# EasyEDA Pro project 轮腿PCB.eprj, schematic Schematic3

## Sheets
1 P1: Board Name: 无刷驱动; Create Date: 2026-03-15
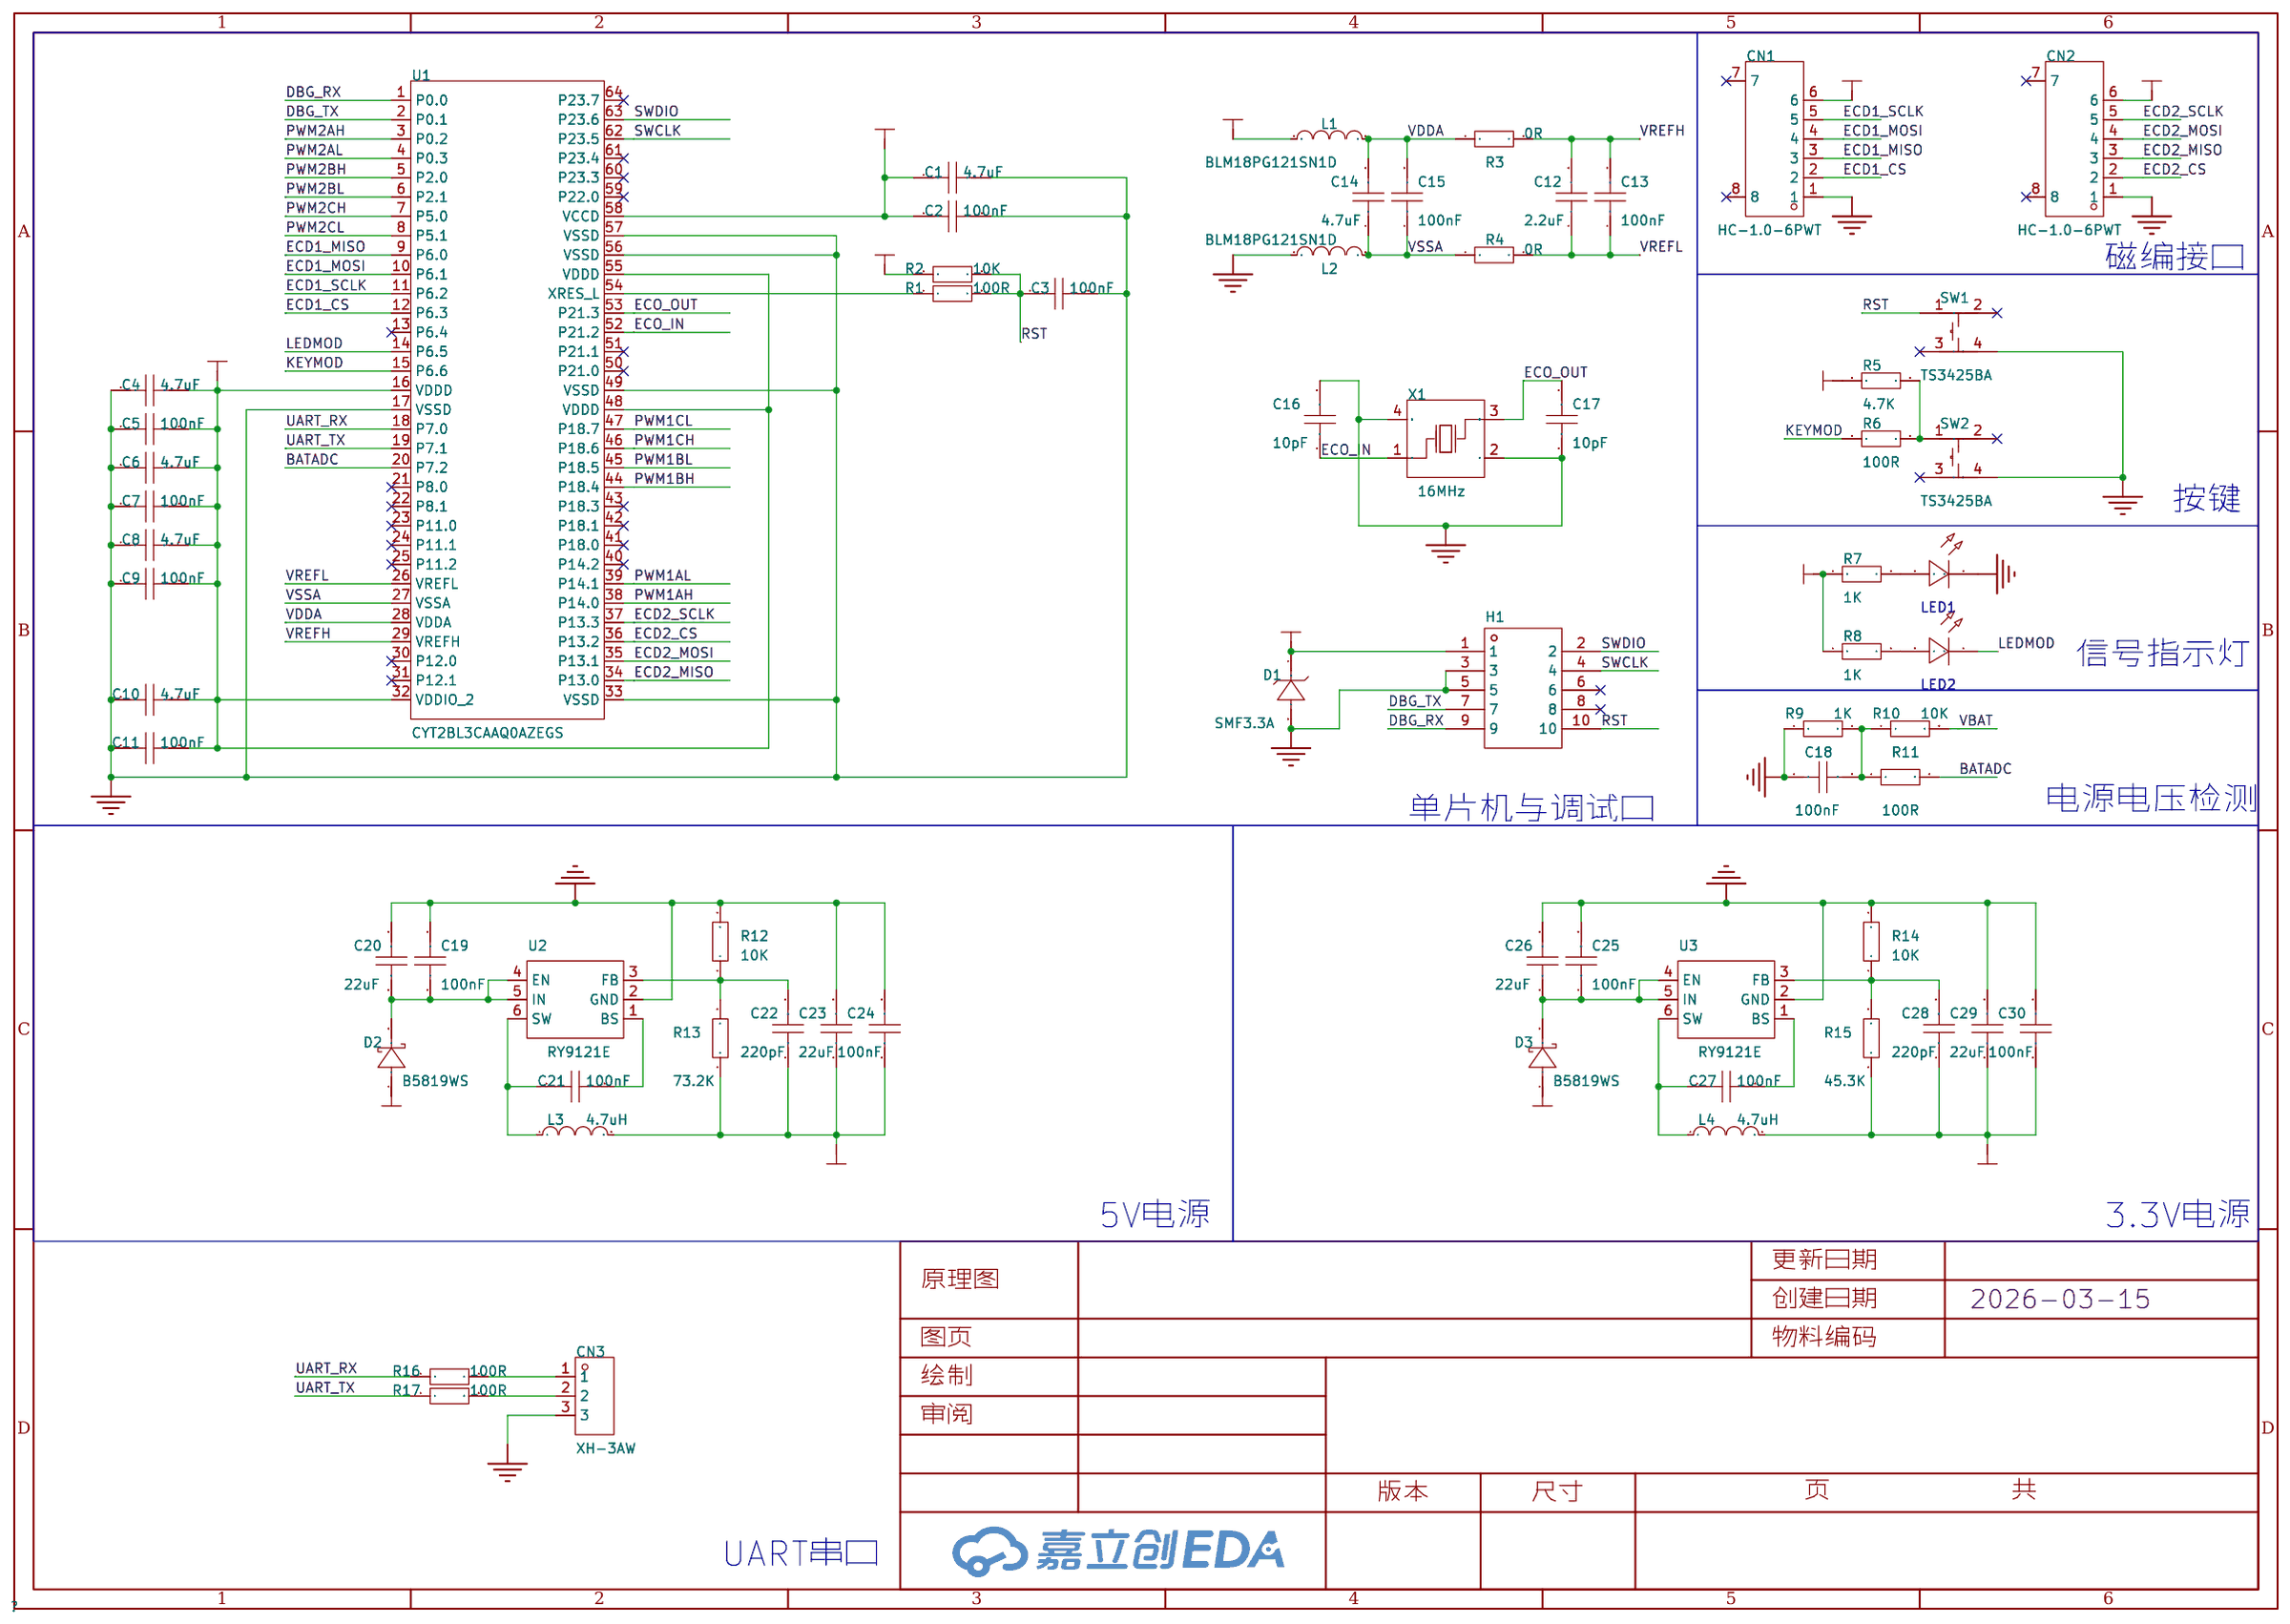
[diagram p3: P1]
2 P2: Create Date: 2026-04-05
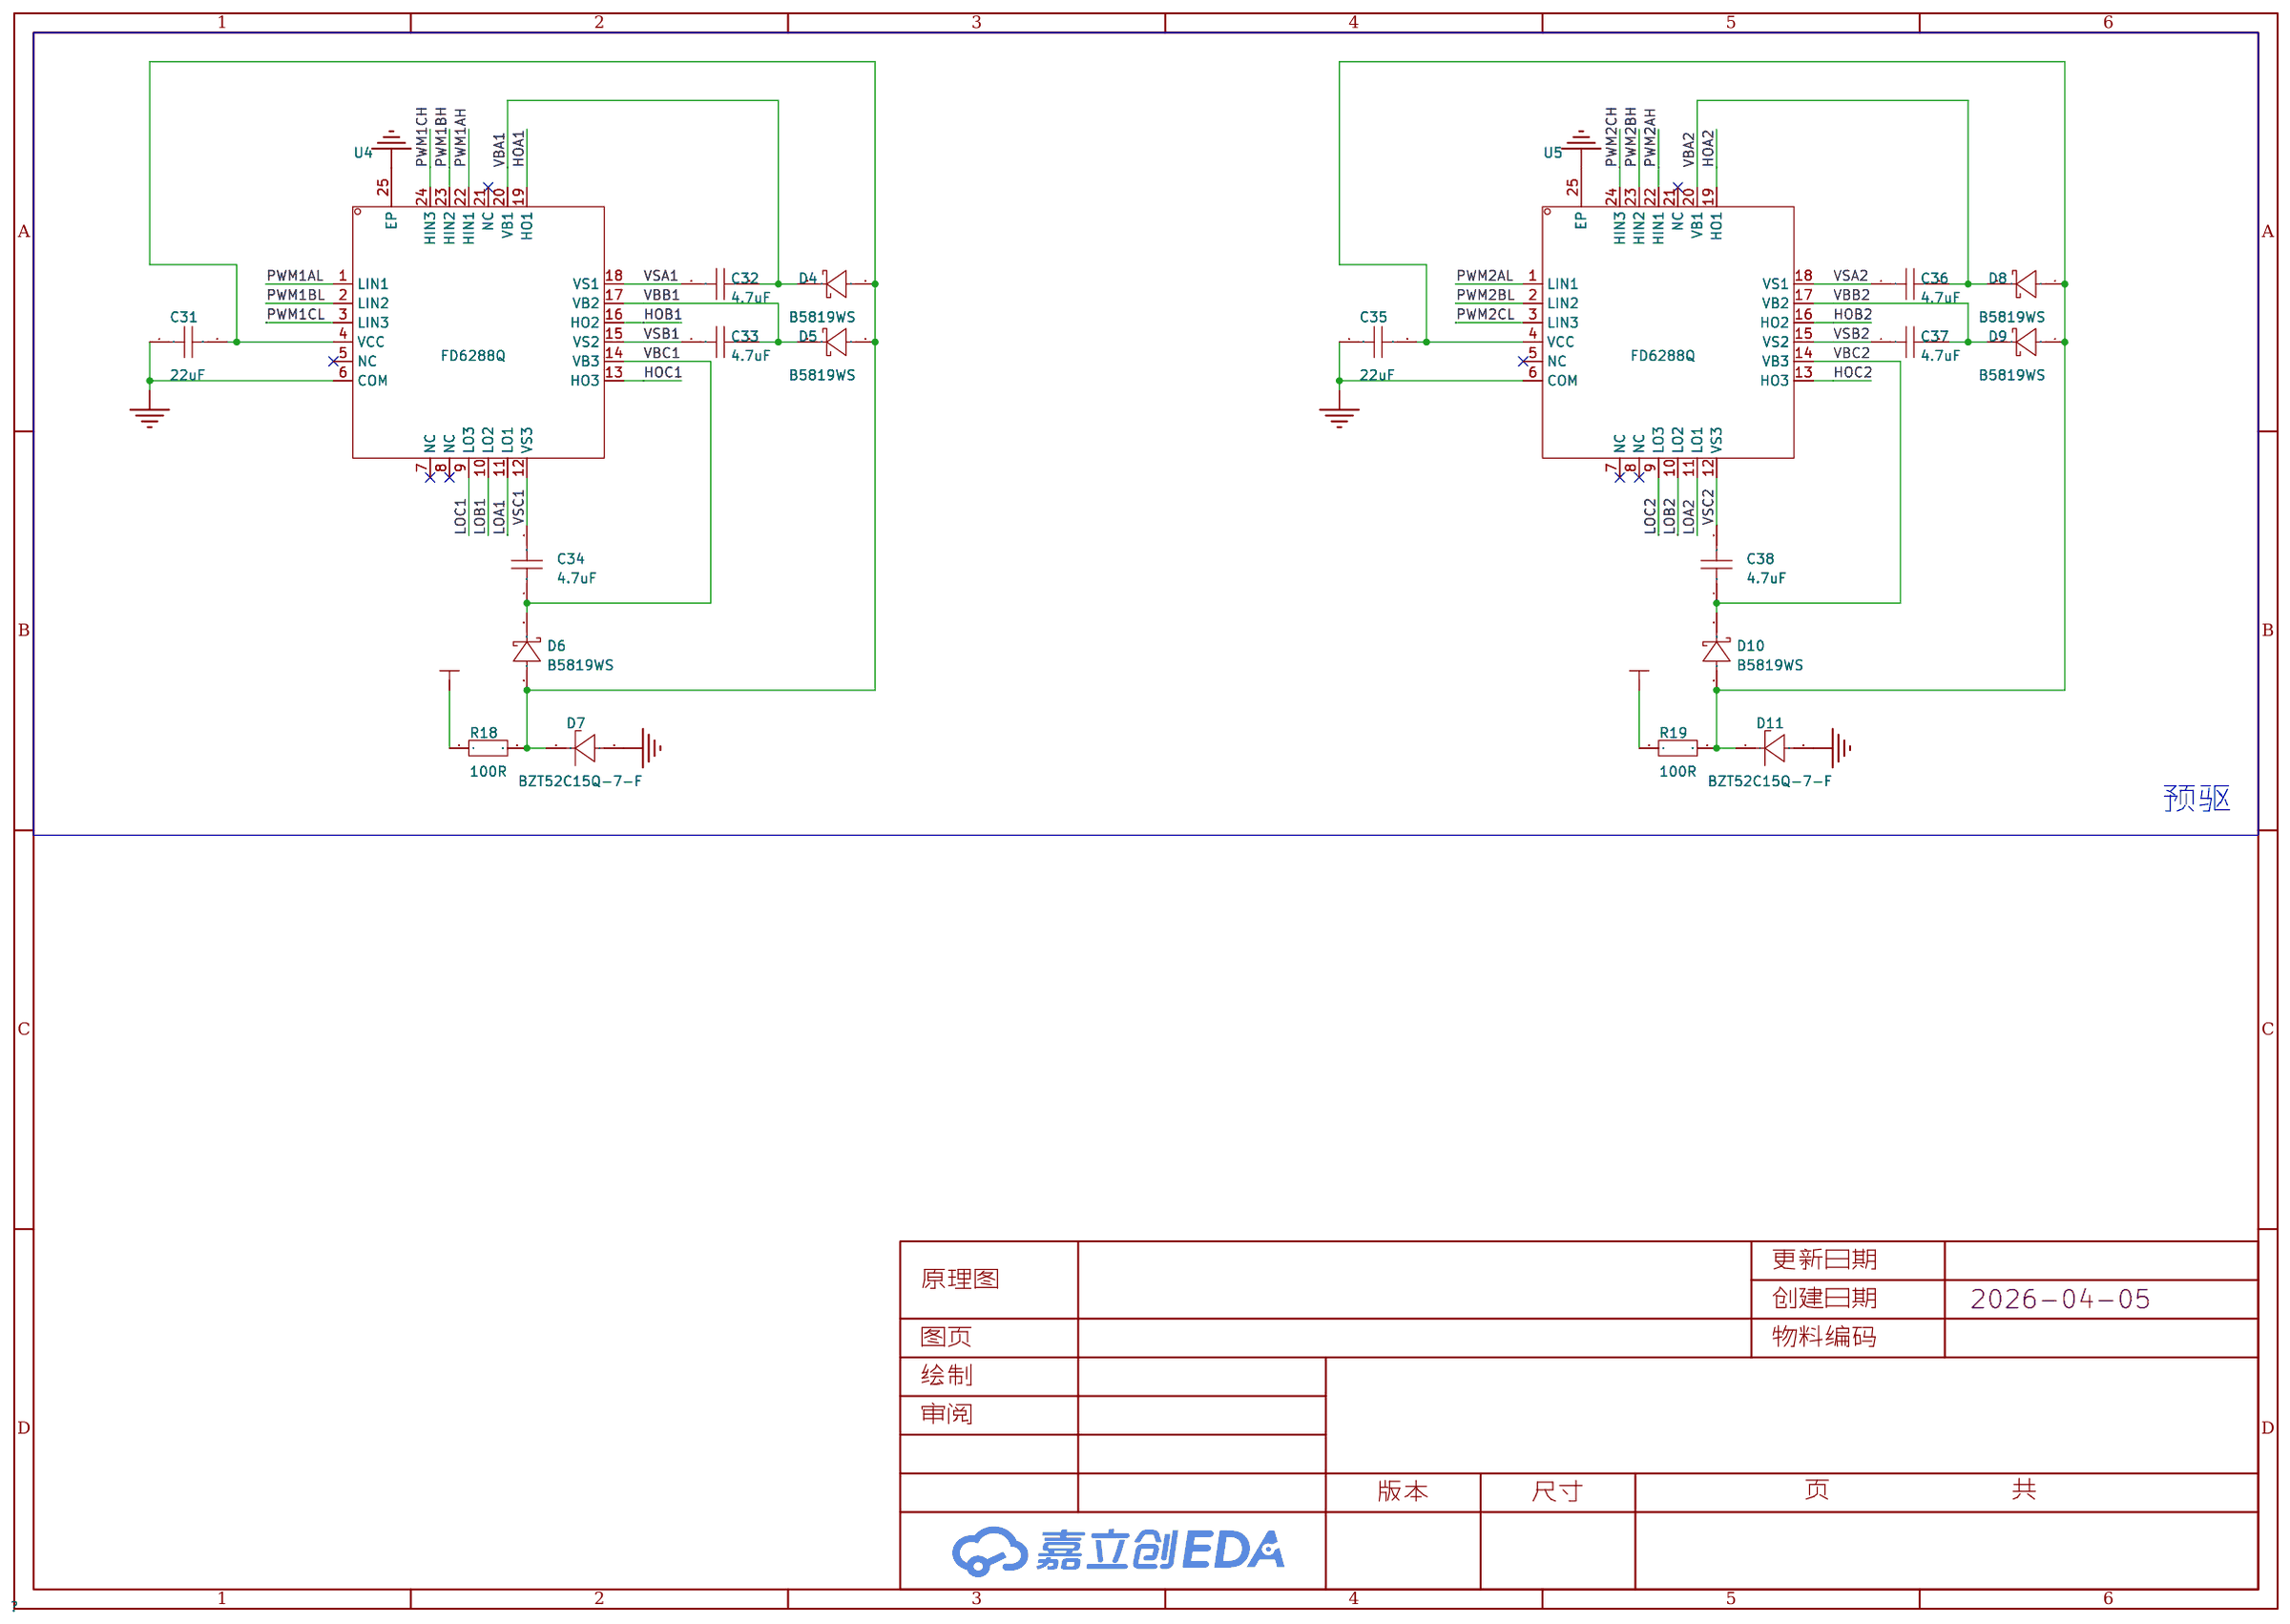
[diagram p4: P2]
3 P3: Create Date: 2026-04-05
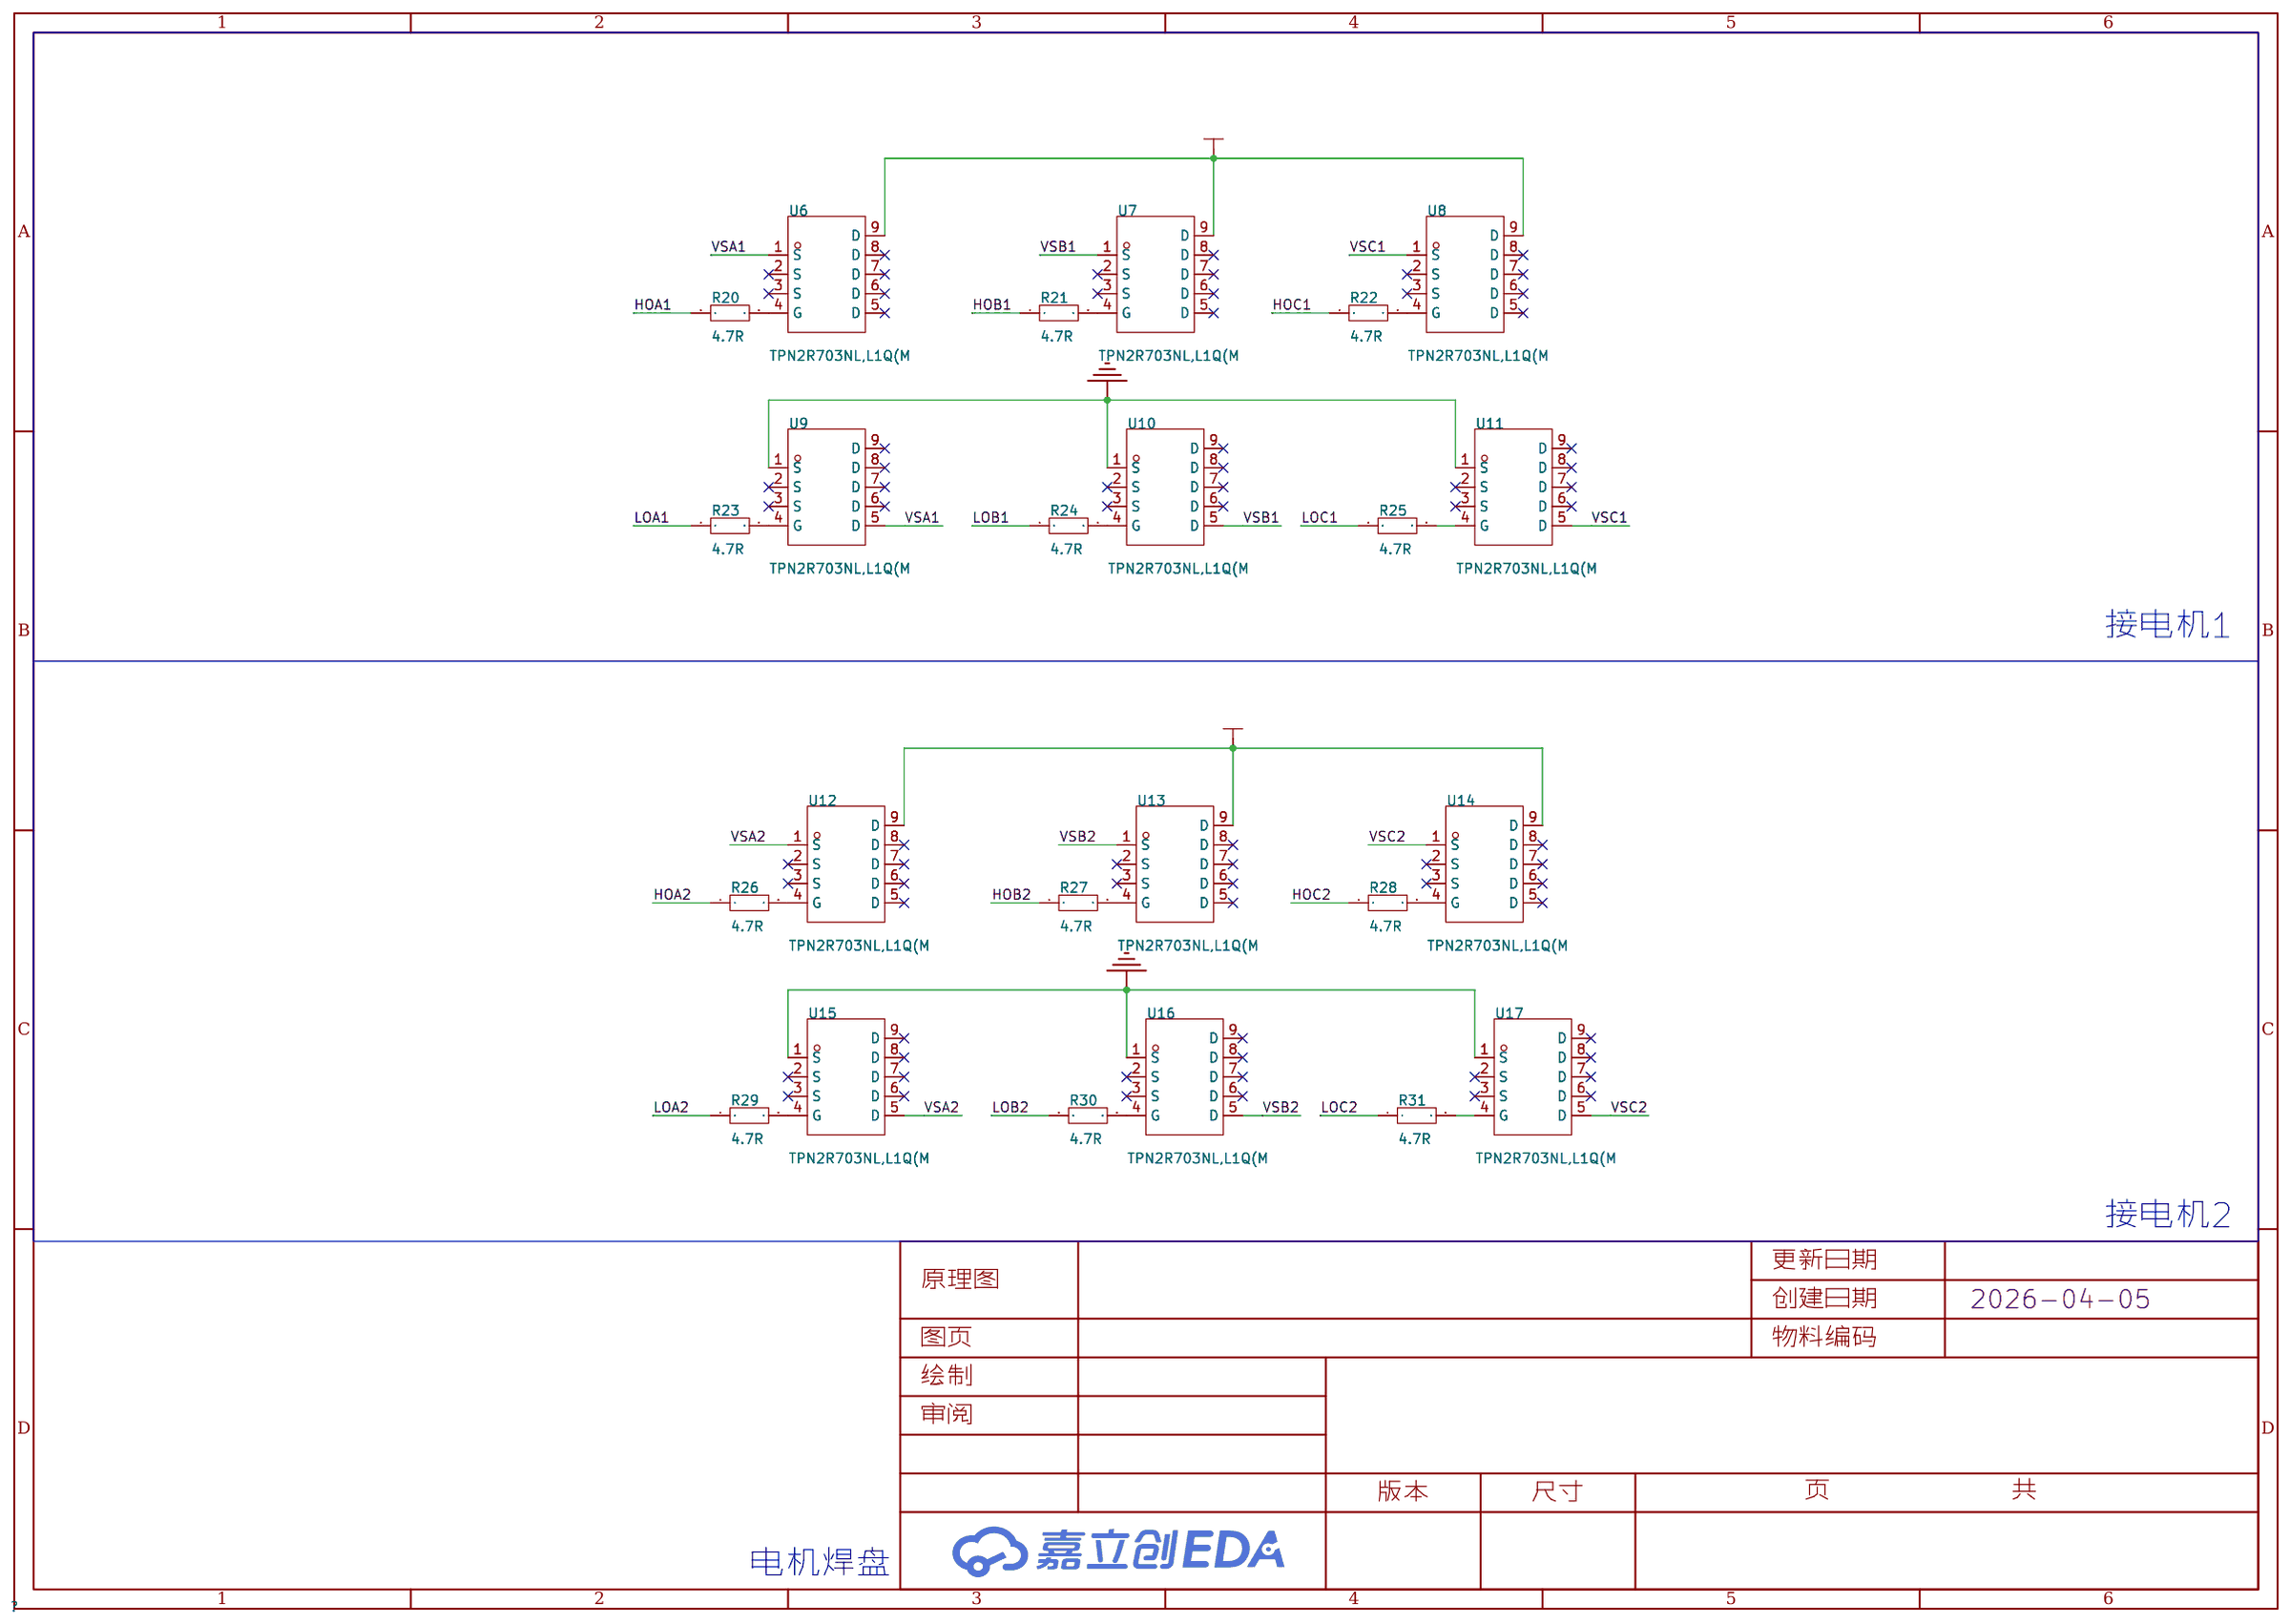
[diagram p5: P3]

## Parts
sheet P1
C1  4.7uF  [C0402]
C2  100nF  [C0402]
C3  100nF  [C0402]
C4  4.7uF  [C0402]
C5  100nF  [C0402]
C6  4.7uF  [C0402]
C7  100nF  [C0402]
C8  4.7uF  [C0402]
C9  100nF  [C0402]
C10  4.7uF  [C0402]
C11  100nF  [C0402]
C12  2.2uF  [C0402]
C13  100nF  [C0402]
C14  4.7uF  [C0402]
C15  100nF  [C0402]
C16  10pF  [C0402]
C17  10pF  [C0402]
C18  100nF  [C0402]
C19  100nF  [C0402]
C20  22uF  [C0402]
C21  100nF  [C0402]
C22  220pF  [C0402]
C23  22uF  [C0402]
C24  100nF  [C0402]
C25  100nF  [C0402]
C26  22uF  [C0402]
C27  100nF  [C0402]
C28  220pF  [C0402]
C29  22uF  [C0402]
C30  100nF  [C0402]
CN1  HC-1.0-6PWT  [CONN-SMD_HCTL_HC-1.0-6PWT]
CN2  HC-1.0-6PWT  [CONN-SMD_HCTL_HC-1.0-6PWT]
CN3  XH-3AW  [CONN-TH_3P-P2.54_HCTL_XH-3AW]
D1  SMF3.3A  [SOD-123FL_L2.7-W1.8-LS3.7-RD]
D2  B5819WS  [SOD-323_L1.7-W1.3-LS2.5-FD]
D3  B5819WS  [SOD-323_L1.7-W1.3-LS2.5-FD]
H1  -  [HDR-TH_10P-P2.54-V-M-R2-C5-S2.54]
L1  BLM18PG121SN1D  [L0603]
L2  BLM18PG121SN1D  [L0603]
L3  4.7uH  [IND-SMD_L4.5-W4.2]
L4  4.7uH  [IND-SMD_L4.5-W4.2]
LED1  -  [LED_0603]
LED2  -  [LED_0603]
R1  100R  [R0603]
R2  10K  [R0603]
R3  0R  [R0603]
R4  0R  [R0603]
R5  4.7K  [R0603]
R6  100R  [R0603]
R7  1K  [R0603]
R8  1K  [R0603]
R9  1K  [R0603]
R10  10K  [R0603]
R11  100R  [R0603]
R12  10K  [R0603]
R13  73.2K  [R0603]
R14  10K  [R0603]
R15  45.3K  [R0603]
R16  100R  [R0603]
R17  100R  [R0603]
SW1  TS3425BA  [SW-SMD_4P-L4.2-W3.2-P2.15-LS4.6-1]
SW2  TS3425BA  [SW-SMD_4P-L4.2-W3.2-P2.15-LS4.6-1]
U1  CYT2BL3CAAQ0AZEGS  [LQFP-64_L10.0-W10.0-P0.50-LS12.0-BL]
U2  RY9121E  [SOT-23-6_L2.9-W1.6-P0.95-LS2.8-BL]
U3  RY9121E  [SOT-23-6_L2.9-W1.6-P0.95-LS2.8-BL]
X1  16MHz  [CRYSTAL-SMD_4P-L3.2-W2.5-BL]
sheet P2
C31  22uF  [C0805]
C32  4.7uF  [C0805]
C33  4.7uF  [C0805]
C34  4.7uF  [C0805]
C35  22uF  [C0805]
C36  4.7uF  [C0805]
C37  4.7uF  [C0805]
C38  4.7uF  [C0805]
D4  B5819WS  [SOD-323_L1.7-W1.3-LS2.5-FD]
D5  B5819WS  [SOD-323_L1.7-W1.3-LS2.5-FD]
D6  B5819WS  [SOD-323_L1.7-W1.3-LS2.5-FD]
D7  BZT52C15Q-7-F  [SOD-123_L2.7-W1.6-LS3.7-RD-1]
D8  B5819WS  [SOD-323_L1.7-W1.3-LS2.5-FD]
D9  B5819WS  [SOD-323_L1.7-W1.3-LS2.5-FD]
D10  B5819WS  [SOD-323_L1.7-W1.3-LS2.5-FD]
D11  BZT52C15Q-7-F  [SOD-123_L2.7-W1.6-LS3.7-RD-1]
R18  100R  [R0603]
R19  100R  [R0603]
U4  FD6288Q  [QFN-24_L4.0-W4.0-P0.50-BL-EP2.6]
U5  FD6288Q  [QFN-24_L4.0-W4.0-P0.50-BL-EP2.6]
sheet P3
R20  4.7R  [R0603]
R21  4.7R  [R0603]
R22  4.7R  [R0603]
R23  4.7R  [R0603]
R24  4.7R  [R0603]
R25  4.7R  [R0603]
R26  4.7R  [R0603]
R27  4.7R  [R0603]
R28  4.7R  [R0603]
R29  4.7R  [R0603]
R30  4.7R  [R0603]
R31  4.7R  [R0603]
U6  TPN2R703NL,L1Q(M  [TSON-8_L3.1-W3.1-P0.65-LS3.3-BL-EP]
U7  TPN2R703NL,L1Q(M  [TSON-8_L3.1-W3.1-P0.65-LS3.3-BL-EP]
U8  TPN2R703NL,L1Q(M  [TSON-8_L3.1-W3.1-P0.65-LS3.3-BL-EP]
U9  TPN2R703NL,L1Q(M  [TSON-8_L3.1-W3.1-P0.65-LS3.3-BL-EP]
U10  TPN2R703NL,L1Q(M  [TSON-8_L3.1-W3.1-P0.65-LS3.3-BL-EP]
U11  TPN2R703NL,L1Q(M  [TSON-8_L3.1-W3.1-P0.65-LS3.3-BL-EP]
U12  TPN2R703NL,L1Q(M  [TSON-8_L3.1-W3.1-P0.65-LS3.3-BL-EP]
U13  TPN2R703NL,L1Q(M  [TSON-8_L3.1-W3.1-P0.65-LS3.3-BL-EP]
U14  TPN2R703NL,L1Q(M  [TSON-8_L3.1-W3.1-P0.65-LS3.3-BL-EP]
U15  TPN2R703NL,L1Q(M  [TSON-8_L3.1-W3.1-P0.65-LS3.3-BL-EP]
U16  TPN2R703NL,L1Q(M  [TSON-8_L3.1-W3.1-P0.65-LS3.3-BL-EP]
U17  TPN2R703NL,L1Q(M  [TSON-8_L3.1-W3.1-P0.65-LS3.3-BL-EP]

## Library data of the parts
C1-C30 = CAP_0402: Supplier Footprint: 0402
CN1 CN2 = HC-1.0-6PWT: LCSC Part Name: 1x6P 间距:1mm 卧贴 系列:SH; Supplier Part: C2845365; Manufacturer: HCTL(华灿天禄); Supplier Footprint: SMD,P=1mm,卧贴; JLCPCB Part Class: 扩展库; Datasheet: https://item.szlcsc.com/datasheet/HC-1.0-6PWT/3039046.html; Supplier: LCSC; Pins Structure: 1x6P; Pitch: 1mm; Mounting Type: 卧贴; Reference Series: SH; Number of Pins: 6P; Number of Rows: 1; Number of PINs Per Row: 6; Current Rating: 1A; Contact Material: 磷青铜; Contact Plating: 锡; Operating Temperature: -25℃~+85℃; Voltage Rating: 50V; Plastic Material: LCP; Flame Retardant Rating: UL94V-0; Supplementary Features: 辅助焊脚; Z-Height of the Board: 3.2mm; X-Length of Bottom Edge on Board (Spacing Line): 8.3mm; Y-Width of Bottom Edge on Board: 5.05mm
CN3 = XH-3AW_C2908612: 插针结构:1x3P;间距:2.54mm;安装方式:弯插;参考系列:XH;总PIN数:3P;排数:1;每排PIN数:3;行距:-;额定电流:3A;触头材质:黄铜;触头镀层:锡;工作温度:-25℃~+85℃;; LCSC Part Name: 1x3P 间距:2.54mm 弯插 系列:XH; Supplier Part: C2908612; Manufacturer: HCTL(华灿天禄); Supplier Footprint: 弯插,P=2.5mm; Datasheet: https://item.szlcsc.com/datasheet/XH-3AW/3184383.html; Supplier: LCSC; Pins Structure: 1x3P; Pitch: 2.54mm; Mounting Type: 弯插; Reference Series: XH; Number of Pins: 3P; Number of Rows: 1; Number of PINs Per Row: 3; Current Rating: 3A; Contact Material: 黄铜; Contact Plating: 锡; Operating Temperature: -25℃~+85℃; Voltage Rating: 250V; Plastic Material: PA66; Flame Retardant Rating: UL94V-0; Z-Height of the Board: 5.9mm; Y-Width of Bottom Edge on Board: 7mm
D1 = SMF3.3A_C51891832: LCSC Part Name: 单向 3.3V 22.7A@10/1000us; Supplier Part: C51891832; Manufacturer: R+O(宏嘉诚); Supplier Footprint: SOD-123FL; JLCPCB Part Class: 扩展库; Datasheet: https://item.szlcsc.com/datasheet/SMF3.3A/54568752.html; Supplier: LCSC; Polarity: 单向; Reverse Stand-Off Voltage (Vrwm): 3.3V; Clamping Voltage: 8.8V; Peak Pulse Current (Ipp): 22.7A@10/1000us; Peak Pulse Power Dissipation (Ppp): 200W@10/1000us; Voltage - Breakdown: 6.5V; Reverse Leakage Current (Ir): 500uA; Number of Channels: 单路; Operating Temperature: -55℃~+150℃; level of protection: IEC 61000-4-2; Type: TVS
D2-D6 D8-D10 = B5819WS_C7420331: LCSC Part Name: 电压:40V 电流:1A; Supplier Part: C7420331; Manufacturer: R+O(宏嘉诚); Supplier Footprint: SOD-323; JLCPCB Part Class: 扩展库; Datasheet: https://item.szlcsc.com/datasheet/B5819WS/8397153.html; Supplier: LCSC; Diode Configuration: 独立式; Voltage - Forward(Vf@If): 600mV@1.0A; Voltage - DC Reverse(Vr): 40V; Current - Rectified: 1A; Reverse Leakage Current (Ir): 1mA@40V; Operating Junction Temperature Range: -55℃~+150℃; Non-Repetitive Peak Forward Surge Current: 10A
H1 = HDR-M_2.54_2x5: Supplier Part: C124387; Supplier Footprint: 插件,P=2.54mm
L1 L2 = BLM18PG121SN1D: LCSC Part Name: 单路 0603磁珠 阻抗120Ω@100MHz; Supplier Part: C14709; Manufacturer: muRata(村田); Supplier Footprint: 0603; Datasheet: https://item.szlcsc.com/datasheet/BLM18PG121SN1D/15379.html; Supplier: LCSC; Impedance @ Frequency: 120Ω@100MHz; Tolerance: ±25%; DC Resistance(DCR): 50mΩ; Current Rating: 2A; Number of Circuits: 1; Operating Temperature: -55℃~+125℃
L3 L4 = PSPMAA0402-4R7M-ANP: LCSC Part Name: 4.7uH ±20% 3.5A; Supplier Part: C436517; Manufacturer: PROD(谱罗德); Supplier Footprint: SMD,4.5x4.1mm; JLCPCB Part Class: 扩展库; Datasheet: https://item.szlcsc.com/datasheet/PSPMAA0402-4R7M-ANP/434296.html; Supplier: LCSC; Tolerance: ±20%; Current Rating: 2A; Current - Saturation(Isat): 3.5A; DC Resistance(DCR): 110mΩ
LED1 LED2 = LED_0603-B: Supplier Footprint: 0603
R1-R31 = Res_0603: Supplier Footprint: 0603
SW1 SW2 = TS3425BA: LCSC Part Name: 4.2*3.2*2.5mm 立贴 电子烟轻触开关; Supplier Part: C2681476; Manufacturer: SHOU HAN(首韩); Supplier Footprint: SMD-4P,4.2x3.2mm; JLCPCB Part Class: 扩展库; Datasheet: https://item.szlcsc.com/datasheet/TS3425BA/2774819.html; Supplier: LCSC; Circuit: 单刀单掷; Actuator Style: 椭圆形按钮; Operating Force: 2.5N; Mounting Type: 立贴; Length: 4.2mm; Width: 3.2mm; Switch Height: 2.5mm; with Bracket: 不带支架; Contact Current: 50mA; Voltage Rating: 12V; Actuator/Cap Color: 白色; With Lamp: 无; Termination Style: J型引脚; Life: 3万次; Operating Temperature: -20℃~+70℃
U1 = CYT2BL3CAAQ0AZEGS: Supplier Part: C5613683; Manufacturer: Infineon(英飞凌); Supplier Footprint: LQFP-64(10x10); JLCPCB Part Class: 扩展库; Datasheet: https://item.szlcsc.com/datasheet/CYT2BL3CAAQ0AZEGS/6532209.html; Supplier: LCSC; CPU Core: ARM-M4F；ARM-M0+; CPU Maximum Speed: 100MHz；160MHz; Number of I/O: 49; ADC (Bit): 12bit; Voltage - Supply: 2.7V~5.5V
U2 U3 = RY9121E: LCSC Part Name: 降压型 2A 4.5V~17V; Supplier Part: C22392164; Manufacturer: RYCHiP(蕊源); Supplier Footprint: SOT-23-6; JLCPCB Part Class: 扩展库; Datasheet: https://item.szlcsc.com/datasheet/RY9121E/23978020.html; Supplier: LCSC; Function: 降压型; Voltage - Supply: 4.5V~17V; Output Current: 2A; Frequency - Switching: 1.2MHz; Operating Temperature: -40℃~+85℃; Synchronous Rectifier: 是; Number of Outputs: 1; Topology: 降压式; Quiescent Current: 600uA; Switch tube (built-in/external): 内置; Output Type: 可调
X1 = TAXM16M4RLBCCT2T: LCSC Part Name: 16MHz ±10ppm 20pF; Supplier Part: C164049; Manufacturer: YJX(雅晶鑫); Supplier Footprint: SMD3225-4P; Datasheet: https://item.szlcsc.com/datasheet/TAXM16M4RLBCCT2T/175431.html; Supplier: LCSC; Type: 贴片晶振; Normal temperature Frequency Tolerance: ±10ppm; Load Capacitance: 20pF; Frequency Stability: ±15ppm; Equivalent Series Resistance(ESR): 40Ω; Operating Temperature: -40℃~+85℃
C31-C38 = CAP_0805: Supplier Footprint: 0805
D7 D11 = BZT52C15Q-7-F: LCSC Part Name: 独立式 耐压:15V 电流:100nA@10.5V; Supplier Part: C507912; Manufacturer: DIODES(美台); Supplier Footprint: SOD-123; JLCPCB Part Class: 扩展库; Datasheet: https://item.szlcsc.com/datasheet/BZT52C15Q-7-F/521838.html; Supplier: LCSC; Diode Configuration: 独立式; Zener Voltage(Nom): 15V; Reverse Leakage Current (Ir): 100nA@10.5V; Zener Voltage(Range): 13.8V~15.6V; Pd - Power Dissipation: 370mW; Impedance(Zzt): 30Ω; Impedance(Zzk): 200Ω; Operating Junction Temperature Range: -65℃~+150℃
U4 U5 = FD6288Q: LCSC Part Name: 三相250V栅极驱动器; Supplier Part: C328453; Manufacturer: Fortior Tech(峰岹); Supplier Footprint: QFN-24-EP(4x4); JLCPCB Part Class: 扩展库; Datasheet: https://item.szlcsc.com/datasheet/FD6288Q/308367.html; Supplier: LCSC; Driven Configuration: 三相; Load Type: MOSFET；IGBT; Number of Drivers: 3; Current - Output Low(IOL): 1.8A; Current - Output High(IOH): 1.5A; Voltage - Supply: 5V~20V; Rise Time: 12ns; Fall Time: 12ns; Propagation Delay tpLH: 300ns; Propagation Delay tpHL: 100ns; Features: 欠压保护(UVP); Operating Temperature: -40℃~+125℃; Input Logic Level - High: 2.7V; Input Logic Level - Low: 800mV; Quiescent Current(Iq): 330uA
U6-U17 = TPN2R703NL,L1Q(M: LCSC Part Name: 1个N沟道 耐压:30V; Supplier Part: C5307666; Manufacturer: TOSHIBA(东芝); Supplier Footprint: TSON-8; JLCPCB Part Class: 扩展库; Datasheet: https://item.szlcsc.com/datasheet/TPN2R703NL%252CL1Q(M/6060841.html; Supplier: LCSC; Number: 1个N沟道; Drain to Source Voltage: 30V; Current - Continuous Drain(Id): 90A; RDS(on): 3.3mΩ@4.5V,22.5A; Pd - Power Dissipation: 42W; Gate Threshold Voltage (Vgs(th)): 1.3V; Gate Charge(Qg): 21nC@10V; Input Capacitance(Ciss): 1.6nF@15V; Reverse Transfer Capacitance (Crss@Vds): 53pF@15V; Type: N沟道; Output Capacitance(Coss): 890pF

## Nets
GND: C1.2 C2.2 C3.2 C4.1 C5.1 C6.1 C7.1 C8.1 C9.1 C10.1 C11.1 C16.2 C17.1 C18.1 C19.2 C20.1 C23.2 C24.2 C25.2 C26.1 C29.2 C30.2 C31.1 C35.1 CN1.1 CN2.1 CN3.3 D1.2(A) D7.2(A) D11.2(A) H1.3 H1.5 L2.1 LED1.1(C) R9.1 R12.2 R14.2 SW1.4 SW2.4 U1.17(VSSD) U1.33(VSSD) U1.49(VSSD) U1.56(VSSD) U1.57(VSSD) U2.2(GND) U3.2(GND) U4.6(COM) U4.25(EP) U5.6(COM) U5.25(EP) U9.1(S) U10.1(S) U11.1(S) U15.1(S) U16.1(S) U17.1(S) X1.2(GND) X1.4(GND)
VBAT: D2.1(A) D3.1(A) R10.2 R18.1 R19.1 U6.9(D) U7.9(D) U8.9(D) U12.9(D) U13.9(D) U14.9(D)
VCC1V1: C1.1 C2.1 U1.58(VCCD)
VCC3V3: C4.2 C5.2 C6.2 C7.2 C8.2 C9.2 C10.2 C11.2 D1.1(C) H1.1 L1.1 R2.1 R5.1 R7.1 R8.1 U1.16(VDDD) U1.32(VDDIO_2) U1.48(VDDD) U1.55(VDDD)
VCC5V: C22.1 C23.1 C24.1 C28.1 C29.1 C30.1 CN1.6 CN2.6 L3.2 L4.2 R13.1 R15.1
VDDA: C14.2 C15.2 L1.2 R3.1 U1.28(VDDA)
VSSA: C14.1 C15.1 L2.2 R4.1 U1.27(VSSA)
BATADC: R11.2 U1.20(P7.2)
DBG_RX: H1.9 U1.1(P0.0)
DBG_TX: H1.7 U1.2(P0.1)
ECD1_CS: CN1.2 U1.12(P6.3)
ECD1_MISO: CN1.3 U1.9(P6.0)
ECD1_MOSI: CN1.4 U1.10(P6.1)
ECD1_SCLK: CN1.5 U1.11(P6.2)
ECD2_CS: CN2.2 U1.36(P13.2)
ECD2_MISO: CN2.3 U1.34(P13.0)
ECD2_MOSI: CN2.4 U1.35(P13.1)
ECD2_SCLK: CN2.5 U1.37(P13.3)
ECO_IN: C16.1 U1.52(P21.2) X1.1(OSC1)
ECO_OUT: C17.2 U1.53(P21.3) X1.3(OSC2)
HOA1: R20.1 U4.19(HO1)
HOA2: R26.1 U5.19(HO1)
HOB1: R21.1 U4.16(HO2)
HOB2: R27.1 U5.16(HO2)
HOC1: R22.1 U4.13(HO3)
HOC2: R28.1 U5.13(HO3)
KEYMOD: R6.1 U1.15(P6.6)
LEDMOD: LED2.1(C) U1.14(P6.5)
LOA1: R23.1 U4.11(LO1)
LOA2: R29.1 U5.11(LO1)
LOB1: R24.1 U4.10(LO2)
LOB2: R30.1 U5.10(LO2)
LOC1: R25.1 U4.9(LO3)
LOC2: R31.1 U5.9(LO3)
PWM1AH: U1.38(P14.0) U4.22(HIN1)
PWM1AL: U1.39(P14.1) U4.1(LIN1)
PWM1BH: U1.44(P18.4) U4.23(HIN2)
PWM1BL: U1.45(P18.5) U4.2(LIN2)
PWM1CH: U1.46(P18.6) U4.24(HIN3)
PWM1CL: U1.47(P18.7) U4.3(LIN3)
PWM2AH: U1.3(P0.2) U5.22(HIN1)
PWM2AL: U1.4(P0.3) U5.1(LIN1)
PWM2BH: U1.5(P2.0) U5.23(HIN2)
PWM2BL: U1.6(P2.1) U5.2(LIN2)
PWM2CH: U1.7(P5.0) U5.24(HIN3)
PWM2CL: U1.8(P5.1) U5.3(LIN3)
RST: C3.1 H1.10 R1.2 R2.2 SW1.1
SWCLK: H1.4 U1.62(P23.5)
SWDIO: H1.2 U1.63(P23.6)
UART_RX: R16.1 U1.18(P7.0)
UART_TX: R17.1 U1.19(P7.1)
VBA1: C32.2 D4.2(K) U4.20(VB1)
VBA2: C36.2 D8.2(K) U5.20(VB1)
VBB1: C33.2 D5.2(K) U4.17(VB2)
VBB2: C37.2 D9.2(K) U5.17(VB2)
VBC1: C34.1 D6.2(K) U4.14(VB3)
VBC2: C38.1 D10.2(K) U5.14(VB3)
VREFH: C12.2 C13.2 R3.2 U1.29(VREFH)
VREFL: C12.1 C13.1 R4.2 U1.26(VREFL)
VSA1: C32.1 U4.18(VS1) U6.1(S) U9.5(D)
VSA2: C36.1 U5.18(VS1) U12.1(S) U15.5(D)
VSB1: C33.1 U4.15(VS2) U7.1(S) U10.5(D)
VSB2: C37.1 U5.15(VS2) U13.1(S) U16.5(D)
VSC1: C34.2 U4.12(VS3) U8.1(S) U11.5(D)
VSC2: C38.2 U5.12(VS3) U14.1(S) U17.5(D)
$1N910: R1.1 U1.54(XRES_L)
$1N4288: R5.2 R6.2 SW2.1
$1N4458: LED1.2(A) R7.2
$1N4485: LED2.2(A) R8.2
$1N4746: C18.2 R9.2 R10.1 R11.1
$1N5165: C19.1 C20.2 D2.2(K) U2.4(EN) U2.5(IN)
$1N5322: C21.1 L3.1 U2.6(SW)
$1N5327: C21.2 U2.1(BS)
$1N5490: C22.2 R12.1 R13.2 U2.3(FB)
$1N6104: C25.1 C26.2 D3.2(K) U3.4(EN) U3.5(IN)
$1N6124: C27.1 L4.1 U3.6(SW)
$1N6129: C27.2 U3.1(BS)
$1N6132: C28.2 R14.1 R15.2 U3.3(FB)
$1N6310: CN3.1 R16.2
$1N6314: CN3.2 R17.2
$2N780: C31.2 D4.1(A) D5.1(A) D6.1(A) D7.1(K) R18.2 U4.4(VCC)
$2N1541: C35.2 D8.1(A) D9.1(A) D10.1(A) D11.1(K) R19.2 U5.4(VCC)
$3N688: R20.2 U6.4(G)
$3N698: R21.2 U7.4(G)
$3N708: R22.2 U8.4(G)
$3N718: R23.2 U9.4(G)
$3N728: R24.2 U10.4(G)
$3N738: R25.2 U11.4(G)
$3N1470: R26.2 U12.4(G)
$3N1478: R27.2 U13.4(G)
$3N1486: R28.2 U14.4(G)
$3N1494: R29.2 U15.4(G)
$3N1499: R30.2 U16.4(G)
$3N1504: R31.2 U17.4(G)

Not connected (* = marked no-connect by the designer): CN1 7* 8*; CN2 7* 8*; H1 6* 8*; SW1 2* 3*; SW2 2* 3*; U1 13(P6.4)* 21(P8.0)* 22(P8.1)* 23(P11.0)* 24(P11.1)* 25(P11.2)* 30(P12.0)* 31(P12.1)* 40(P14.2)* 41(P18.0)* 42(P18.1)* 43(P18.3)* 50(P21.0)* 51(P21.1)* 59(P22.0)* 60(P23.3)* 61(P23.4)* 64(P23.7)*; U4 5(NC)* 7(NC)* 8(NC)* 21(NC)*; U5 5(NC)* 7(NC)* 8(NC)* 21(NC)*; U6 2(S)* 3(S)* 5(D)* 6(D)* 7(D)* 8(D)*; U7 2(S)* 3(S)* 5(D)* 6(D)* 7(D)* 8(D)*; U8 2(S)* 3(S)* 5(D)* 6(D)* 7(D)* 8(D)*; U9 2(S)* 3(S)* 6(D)* 7(D)* 8(D)* 9(D)*; U10 2(S)* 3(S)* 6(D)* 7(D)* 8(D)* 9(D)*; U11 2(S)* 3(S)* 6(D)* 7(D)* 8(D)* 9(D)*; U12 2(S)* 3(S)* 5(D)* 6(D)* 7(D)* 8(D)*; U13 2(S)* 3(S)* 5(D)* 6(D)* 7(D)* 8(D)*; U14 2(S)* 3(S)* 5(D)* 6(D)* 7(D)* 8(D)*; U15 2(S)* 3(S)* 6(D)* 7(D)* 8(D)* 9(D)*; U16 2(S)* 3(S)* 6(D)* 7(D)* 8(D)* 9(D)*; U17 2(S)* 3(S)* 6(D)* 7(D)* 8(D)* 9(D)*

## Notes on the sheets
sheet 1
- 磁编接口
- 按键
- 信号指示灯
- 电源电压检测
- 单片机与调试口
- 5V电源
- 3.3V电源
- UART串口
sheet 2
- 预驱
sheet 3
- 接电机1
- 接电机2
- 电机焊盘
